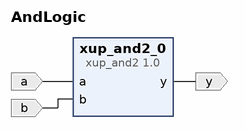
[diagram p0: block diagram of the top level]
# Vivado block design AndLogic, Vivado 2015.3
create_bd_design AndLogic

create_bd_port -dir I a
create_bd_port -dir I b
create_bd_port -dir O y

create_bd_cell -type ip -vlnv xilinx.com:xup:xup_and2:1.0 xup_and2_0
set_property -dict {CONFIG.DELAY 5} [get_bd_cells xup_and2_0]

# ---- connections ----

connect_bd_net [get_bd_ports a] [get_bd_pins xup_and2_0/a]
connect_bd_net [get_bd_ports b] [get_bd_pins xup_and2_0/b]
connect_bd_net [get_bd_pins xup_and2_0/y] [get_bd_ports y]

validate_bd_design
save_bd_design
